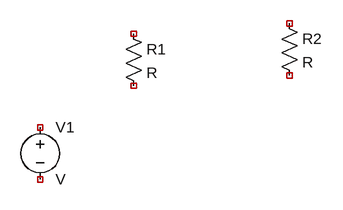
[diagram p0: schematic Draft1.asc]
Draft1.asc, the LTspice schematic file:
Version 4
SHEET 1 880 680
SYMBOL voltage -224 -192 R0
SYMATTR InstName V1
SYMBOL res -96 -336 R0
SYMATTR InstName R1
SYMBOL res 144 -352 R0
SYMATTR InstName R2

The netlist it stands for:
* Draft1.asc
V1 NC_01 NC_02 V
R1 NC_03 NC_04 R
R2 NC_05 NC_06 R
.backanno
.end